# EAGLE design manual_master (EAGLE 8.0.1)
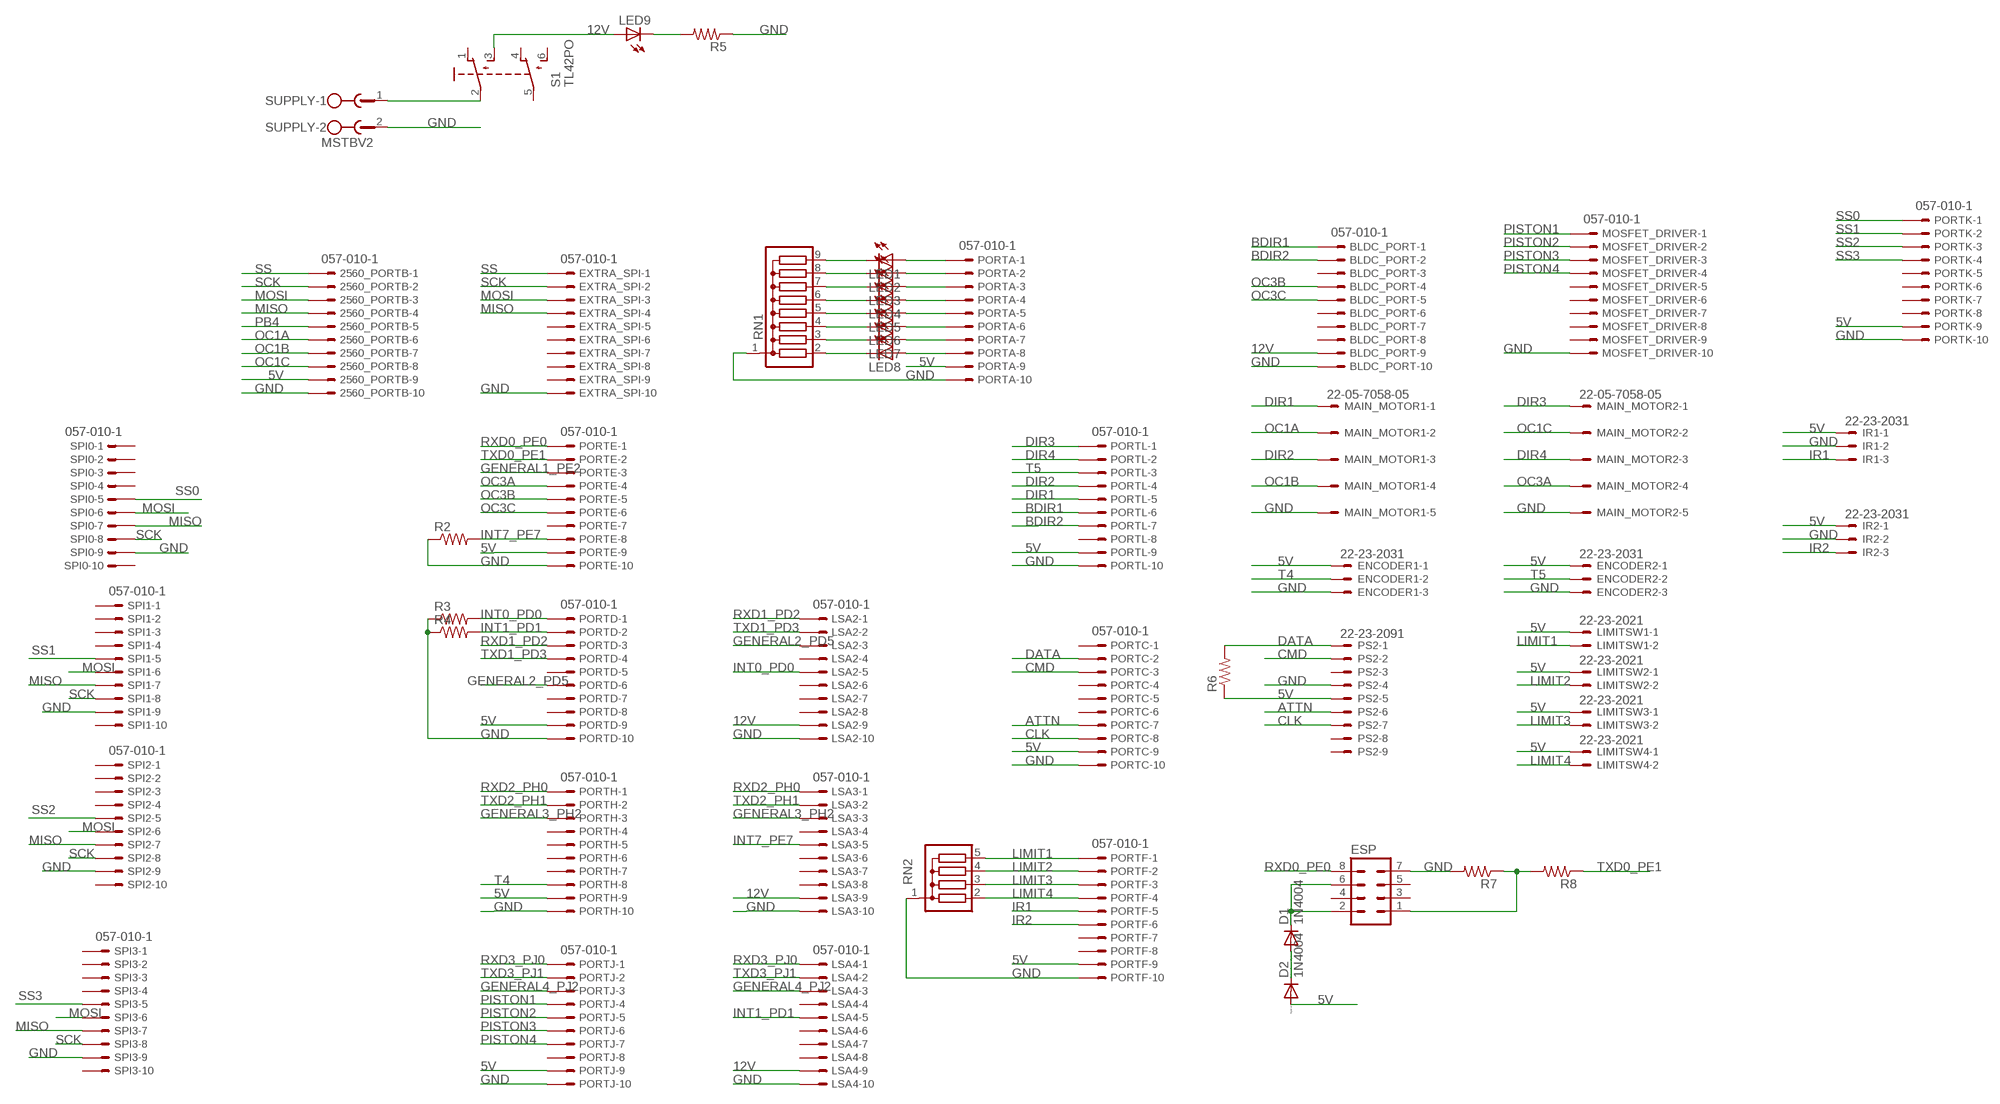
[diagram p0: schematic, sheet 1]

## Parts
2560_PORTB  057-010-1  [057-010-1]
BLDC_PORT  057-010-1  [057-010-1]
D1  1N4004  [DO41-10]
D2  1N4004  [DO41-10]
ENCODER1  22-23-2031  [22-23-2031]
ENCODER2  22-23-2031  [22-23-2031]
ESP  MA04-2  [MA04-2]
EXTRA_SPI  057-010-1  [057-010-1]
IR1  22-23-2031  [22-23-2031]
IR2  22-23-2031  [22-23-2031]
LED1  LED3MM  [LED3MM]
LED2  LED3MM  [LED3MM]
LED3  LED3MM  [LED3MM]
LED4  LED3MM  [LED3MM]
LED5  LED3MM  [LED3MM]
LED6  LED3MM  [LED3MM]
LED7  LED3MM  [LED3MM]
LED8  LED3MM  [LED3MM]
LED9  LED5MM  [LED5MM]
LIMITSW1  22-23-2021  [22-23-2021]
LIMITSW2  22-23-2021  [22-23-2021]
LIMITSW3  22-23-2021  [22-23-2021]
LIMITSW4  22-23-2021  [22-23-2021]
LSA2  057-010-1  [057-010-1]
LSA3  057-010-1  [057-010-1]
LSA4  057-010-1  [057-010-1]
MAIN_MOTOR1  22-05-7058-05  [7395-05]
MAIN_MOTOR2  22-05-7058-05  [7395-05]
MOSFET_DRIVER  057-010-1  [057-010-1]
PORTA  057-010-1  [057-010-1]
PORTC  057-010-1  [057-010-1]
PORTD  057-010-1  [057-010-1]
PORTE  057-010-1  [057-010-1]
PORTF  057-010-1  [057-010-1]
PORTH  057-010-1  [057-010-1]
PORTJ  057-010-1  [057-010-1]
PORTK  057-010-1  [057-010-1]
PORTL  057-010-1  [057-010-1]
PS2  22-23-2091  [22-23-2091]
R2  R-US_0207/10  [0207/10]
R3  R-US_0207/10  [0207/10]
R4  R-US_0207/10  [0207/10]
R5  R-US_0207/10  [0207/10]
R6  R-US_0207/10  [0207/10]
R7  R-US_0207/10  [0207/10]
R8  R-US_0207/10  [0207/10]
RN1  G08R  [SIL9]
RN2  G04R  [SIL5]
S1  TL42PO  [TL4XPO]
SPI0  057-010-1  [057-010-1]
SPI1  057-010-1  [057-010-1]
SPI2  057-010-1  [057-010-1]
SPI3  057-010-1  [057-010-1]
SUPPLY  MSTBV2  [MSTBV2]

## Nets
5V: 2560_PORTB.9 D2.A ENCODER1.1 ENCODER2.1 IR1.1 IR2.1 LIMITSW1.1 LIMITSW2.1 LIMITSW3.1 LIMITSW4.1 PORTA.9 PORTC.9 PORTD.9 PORTE.9 PORTF.9 PORTH.9 PORTJ.9 PORTK.9 PORTL.9 PS2.5 R6.1
12V: BLDC_PORT.9 LED9.A LSA2.9 LSA3.9 LSA4.9 S1.3(S)
ATTN: PORTC.7 PS2.6
BDIR1: BLDC_PORT.1 PORTL.6
BDIR2: BLDC_PORT.2 PORTL.7
CLK: PORTC.8 PS2.7
CMD: PORTC.3 PS2.2
DATA: PORTC.2 PS2.1 R6.2
DIR1: MAIN_MOTOR1.1 PORTL.5
DIR2: MAIN_MOTOR1.3 PORTL.4
DIR3: MAIN_MOTOR2.1 PORTL.1
DIR4: MAIN_MOTOR2.3 PORTL.2
GENERAL1_PE2: PORTE.3
GENERAL2_PD5: LSA2.3 PORTD.6
GENERAL3_PH2: LSA3.3 PORTH.3
GENERAL4_PJ2: LSA4.3 PORTJ.3
GND: 2560_PORTB.10 BLDC_PORT.10 ENCODER1.3 ENCODER2.3 ESP.7 EXTRA_SPI.10 IR1.2 IR2.2 LSA2.10 LSA3.10 LSA4.10 MAIN_MOTOR1.5 MAIN_MOTOR2.5 MOSFET_DRIVER.10 PORTA.10 PORTC.10 PORTD.10 PORTE.10 PORTF.10 PORTH.10 PORTJ.10 PORTK.10 PORTL.10 PS2.4 R2.1 R3.1 R4.1 R5.1 R7.2 RN1.1 RN2.1 SPI0.9 SPI1.9 SPI2.9 SPI3.9 SUPPLY.2
INT0_PD0: LSA2.5 PORTD.1 R3.2
INT1_PD1: LSA4.5 PORTD.2 R4.2
INT7_PE7: LSA3.5 PORTE.8 R2.2
IR1: IR1.3 PORTF.5
IR2: IR2.3 PORTF.6
LIMIT1: LIMITSW1.2 PORTF.1 RN2.5
LIMIT2: LIMITSW2.2 PORTF.2 RN2.4
LIMIT3: LIMITSW3.2 PORTF.3 RN2.3
LIMIT4: LIMITSW4.2 PORTF.4 RN2.2
MISO: 2560_PORTB.4 EXTRA_SPI.4 SPI0.7 SPI1.7 SPI2.7 SPI3.7
MOSI: 2560_PORTB.3 EXTRA_SPI.3 SPI0.6 SPI1.6 SPI2.6 SPI3.6
N$1: D1.A D2.C
N$2: D1.C ESP.2 ESP.6
N$3: S1.2(P) SUPPLY.1
N$4: LED9.K(C) R5.2
N$7: LED1.A PORTA.1
N$12: LED2.A PORTA.2
N$13: LED3.A PORTA.3
N$14: LED4.A PORTA.4
N$15: LED5.A PORTA.5
N$16: LED6.A PORTA.6
N$17: LED7.A PORTA.7
N$18: LED8.A PORTA.8
N$19: LED1.K(C) RN1.9
N$20: LED2.K(C) RN1.8
N$21: ESP.1 R7.1 R8.2
N$22: LED3.K(C) RN1.7
N$23: LED4.K(C) RN1.6
N$24: LED5.K(C) RN1.5
N$25: LED6.K(C) RN1.4
N$26: LED7.K(C) RN1.3
N$27: LED8.K(C) RN1.2
OC1A: 2560_PORTB.6 MAIN_MOTOR1.2
OC1B: 2560_PORTB.7 MAIN_MOTOR1.4
OC1C: 2560_PORTB.8 MAIN_MOTOR2.2
OC3A: MAIN_MOTOR2.4 PORTE.4
OC3B: BLDC_PORT.4 PORTE.5
OC3C: BLDC_PORT.5 PORTE.6
PB4: 2560_PORTB.5
PISTON1: MOSFET_DRIVER.1 PORTJ.4
PISTON2: MOSFET_DRIVER.2 PORTJ.5
PISTON3: MOSFET_DRIVER.3 PORTJ.6
PISTON4: MOSFET_DRIVER.4 PORTJ.7
RXD0_PE0: ESP.8 PORTE.1
RXD1_PD2: LSA2.1 PORTD.3
RXD2_PH0: LSA3.1 PORTH.1
RXD3_PJ0: LSA4.1 PORTJ.1
SCK: 2560_PORTB.2 EXTRA_SPI.2 SPI0.8 SPI1.8 SPI2.8 SPI3.8
SS: 2560_PORTB.1 EXTRA_SPI.1
SS0: PORTK.1 SPI0.5
SS1: PORTK.2 SPI1.5
SS2: PORTK.3 SPI2.5
SS3: PORTK.4 SPI3.5
T4: ENCODER1.2 PORTH.8
T5: ENCODER2.2 PORTL.3
TXD0_PE1: PORTE.2 R8.1
TXD1_PD3: LSA2.2 PORTD.4
TXD2_PH1: LSA3.2 PORTH.2
TXD3_PJ1: LSA4.2 PORTJ.2
Unconnected: BLDC_PORT.3 BLDC_PORT.6 BLDC_PORT.7 BLDC_PORT.8 ESP.3 ESP.4 ESP.5 EXTRA_SPI.5 EXTRA_SPI.6 EXTRA_SPI.7 EXTRA_SPI.8 EXTRA_SPI.9 LSA2.4 LSA2.6 LSA2.7 LSA2.8 LSA3.4 LSA3.6 LSA3.7 LSA3.8 LSA4.4 LSA4.6 LSA4.7 LSA4.8 MOSFET_DRIVER.5 MOSFET_DRIVER.6 MOSFET_DRIVER.7 MOSFET_DRIVER.8 MOSFET_DRIVER.9 PORTC.1 PORTC.4 PORTC.5 PORTC.6 PORTD.5 PORTD.7 PORTD.8 PORTE.7 PORTF.7 PORTF.8 PORTH.4 PORTH.5 PORTH.6 PORTH.7 PORTJ.8 PORTK.5 PORTK.6 PORTK.7 PORTK.8 PORTL.8 PS2.3 PS2.8 PS2.9 S1.1(O) S1.4(O1) S1.5(P1) S1.6(S1) SPI0.1 SPI0.2 SPI0.3 SPI0.4 SPI0.10 SPI1.1 SPI1.2 SPI1.3 SPI1.4 SPI1.10 SPI2.1 SPI2.2 SPI2.3 SPI2.4 SPI2.10 SPI3.1 SPI3.2 SPI3.3 SPI3.4 SPI3.10

## Library data of the parts
2560_PORTB BLDC_PORT EXTRA_SPI LSA2-LSA4 MOSFET_DRIVER PORTA PORTC PORTD PORTE PORTF PORTH PORTJ PORTK PORTL SPI0 SPI1-SPI3 = con-panduit:057-010-: CONNECTOR 10-pin series 057 contact pc board low profile headers; OC_FARNELL: unknown; OC_NEWARK: unknown
D1 D2 = diode:1N4004: DIODE general purpose rectifier, 1 A
ENCODER1 ENCODER2 IR1 IR2 = con-molex:22-23-2031: .100" (2.54mm) Center Header - 3 Pin; MF: MOLEX; MPN: 22-23-2031; OC_FARNELL: 1462950; OC_NEWARK: 30C0862
ESP = con-lstb:MA04-2: PIN HEADER; OC_FARNELL: unknown; OC_NEWARK: unknown
LED1-LED9 = led:LED: LED OSRAM: - CHIPLED LG R971, LG N971, LY N971, LG Q971, LY Q971, LO R971, LY R971 LH N974, LH R974 LS Q976, LO Q976, LY Q976 LO Q996 - Hyper CHIPLED LW Q18S LB Q993, LB Q99A, LB R99A - SideLED LS A670, LO A670, LY A670, LG A670, LP A670 LB A673, LV A673, LT A673, LW A673 LH A674 LY A675 LS A676, LA A676, LO A676, LY A676, LW A676 LS A679, LY A679, LG A679 - Hyper Micro SIDELED® LS Y876, LA Y876, LO Y876, LY Y876 LT Y87S - SmartLED LW L88C, LW L88S LB L89C, LB L89S, LG L890 LS L89K, LO L89K, LY L89K LS L896, LA L896, LO L896, LY L896 - TOPLED LS T670, LO T670, LY T670, LG T670, LP T670 LSG T670, LSP T670, LSY T670, LOP T670, LYG T670 LG T671, LOG T671, LSG T671 LB T673, LV T673, LT T673, LW T673 LH T674 LS T676, LA T676, LO T676, LY T676, LB T676, LH T676, LSB T676, LW T676 LB T67C, LV T67C, LT T67C, LS T67K, LO T67K, LY T67K, LW E67C LS E67B, LA E67B, LO E67B, LY E67B, LB E67C, LV E67C, LT E67C LW T67C LS T679, LY T679, LG T679 LS T770, LO T770, LY T770, LG T770, LP T770 LB T773, LV T773, LT T773, LW T773 LH T774 LS E675, LA E675, LY E675, LS T675 LS T776, LA T776, LO T776, LY T776, LB T776 LHGB T686 LT T68C, LB T68C - Hyper Mini TOPLED® LB M676 - Mini TOPLED Santana® LG M470 LS M47K, LO M47K, LY M47K Source: http://www.osram.convergy.de LUXEON: - LUMILED® LXK2-PW12-R00, LXK2-PW12-S00, LXK2-PW14-U00, LXK2-PW14-V00 LXK2-PM12-R00, LXK2-PM12-S00, LXK2-PM14-U00 LXK2-PE12-Q00, LXK2-PE12-R00, LXK2-PE12-S00, LXK2-PE14-T00, LXK2-PE14-U00 LXK2-PB12-K00, LXK2-PB12-L00, LXK2-PB12-M00, LXK2-PB14-N00, LXK2-PB14-P00, LXK2-PB14-Q00 LXK2-PR12-L00, LXK2-PR12-M00, LXK2-PR14-Q00, LXK2-PR14-R00 LXK2-PD12-Q00, LXK2-PD12-R00, LXK2-PD12-S00 LXK2-PH12-R00, LXK2-PH12-S00 LXK2-PL12-P00, LXK2-PL12-Q00, LXK2-PL12-R00 Source: www.luxeon.com KINGBRIGHT: KA-3528ASYC Source: www.kingbright.com
LIMITSW1-LIMITSW4 = con-molex:22-23-2021: .100" (2.54mm) Center Header - 2 Pin; MF: MOLEX; MPN: 22-23-2021; OC_FARNELL: 1462926; OC_NEWARK: 25C3832
MAIN_MOTOR1 MAIN_MOTOR2 = con-molex:22-?-05: CONNECTOR wire to board 2.54 mm (.1 inch) pitch header; OC_FARNELL: unknown; OC_NEWARK: unknown
PS2 = con-molex:22-23-2091: .100" (2.54mm) Center Header - 9 Pin; MF: MOLEX; MPN: 22-23-2091; OC_FARNELL: 1756827; OC_NEWARK: 56H0450
R2-R8 = rcl:R-US_: RESISTOR, American symbol
RN1 = resistor-sil:G08R: SIL RESISTOR; OC_FARNELL: unknown; OC_NEWARK: unknown
RN2 = resistor-sil:G04R: SIL RESISTOR; OC_FARNELL: unknown; OC_NEWARK: unknown
S1 = switch:TL42PO: TINY SWITCH ON - MOM Source: http://www2.produktinfo.conrad.com/datenblaetter/700000-724999/705152-da-01-de-Subminiaturschalter_TL_36YO.pdf
SUPPLY = con-phoenix-508:MSTBV2: PHOENIX; MPN: MSTBV 2,5/2-GF-5.08; OC_FARNELL: 1792792; OC_NEWARK: 69R9845

## Board
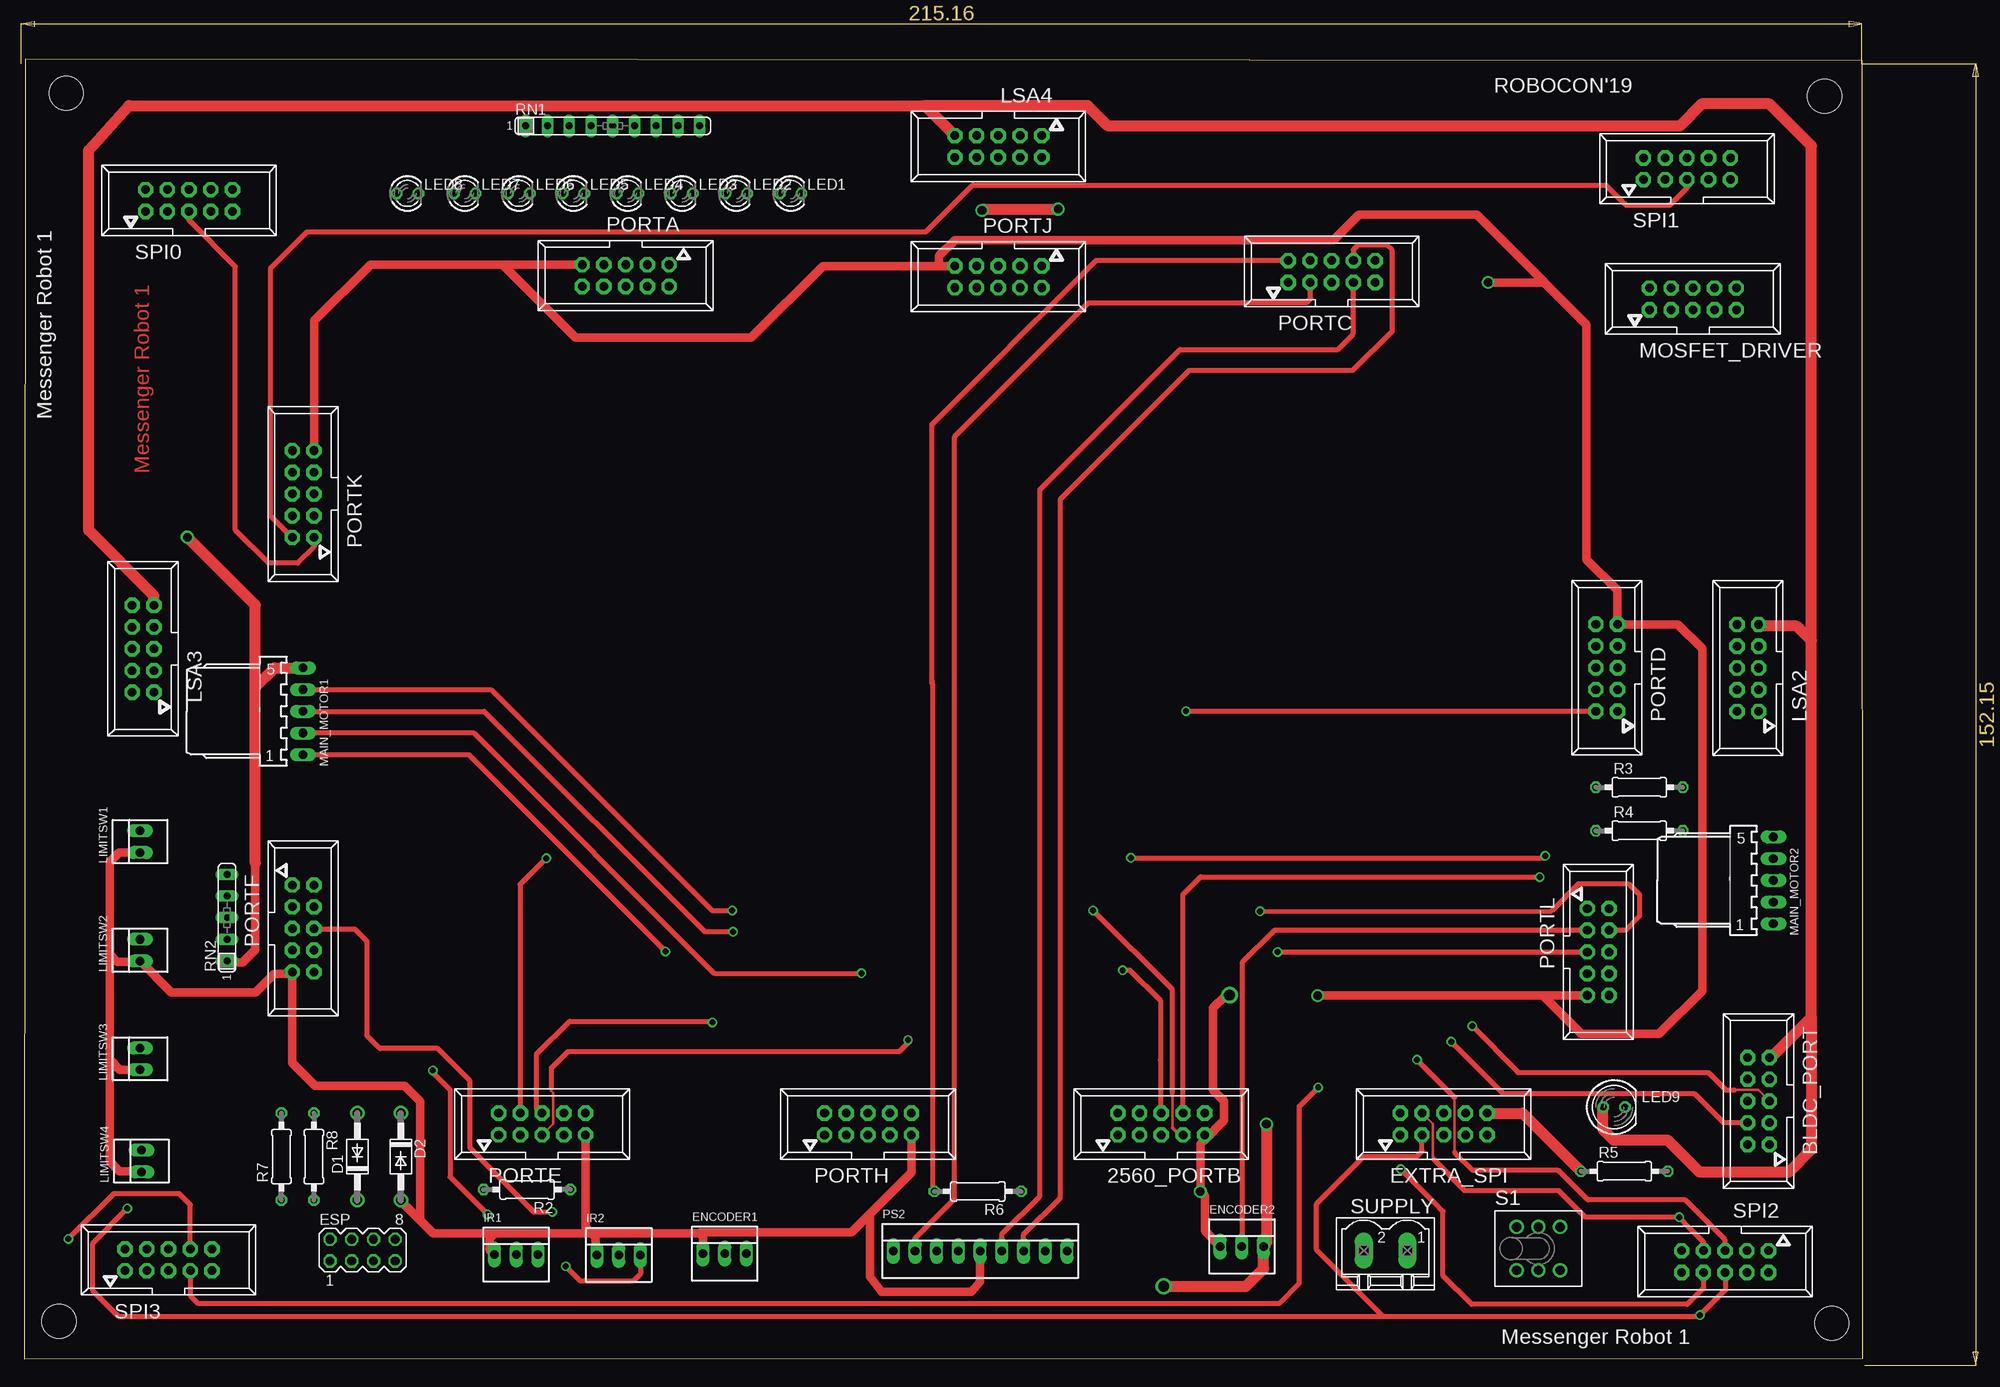
[diagram p1: board, top side]
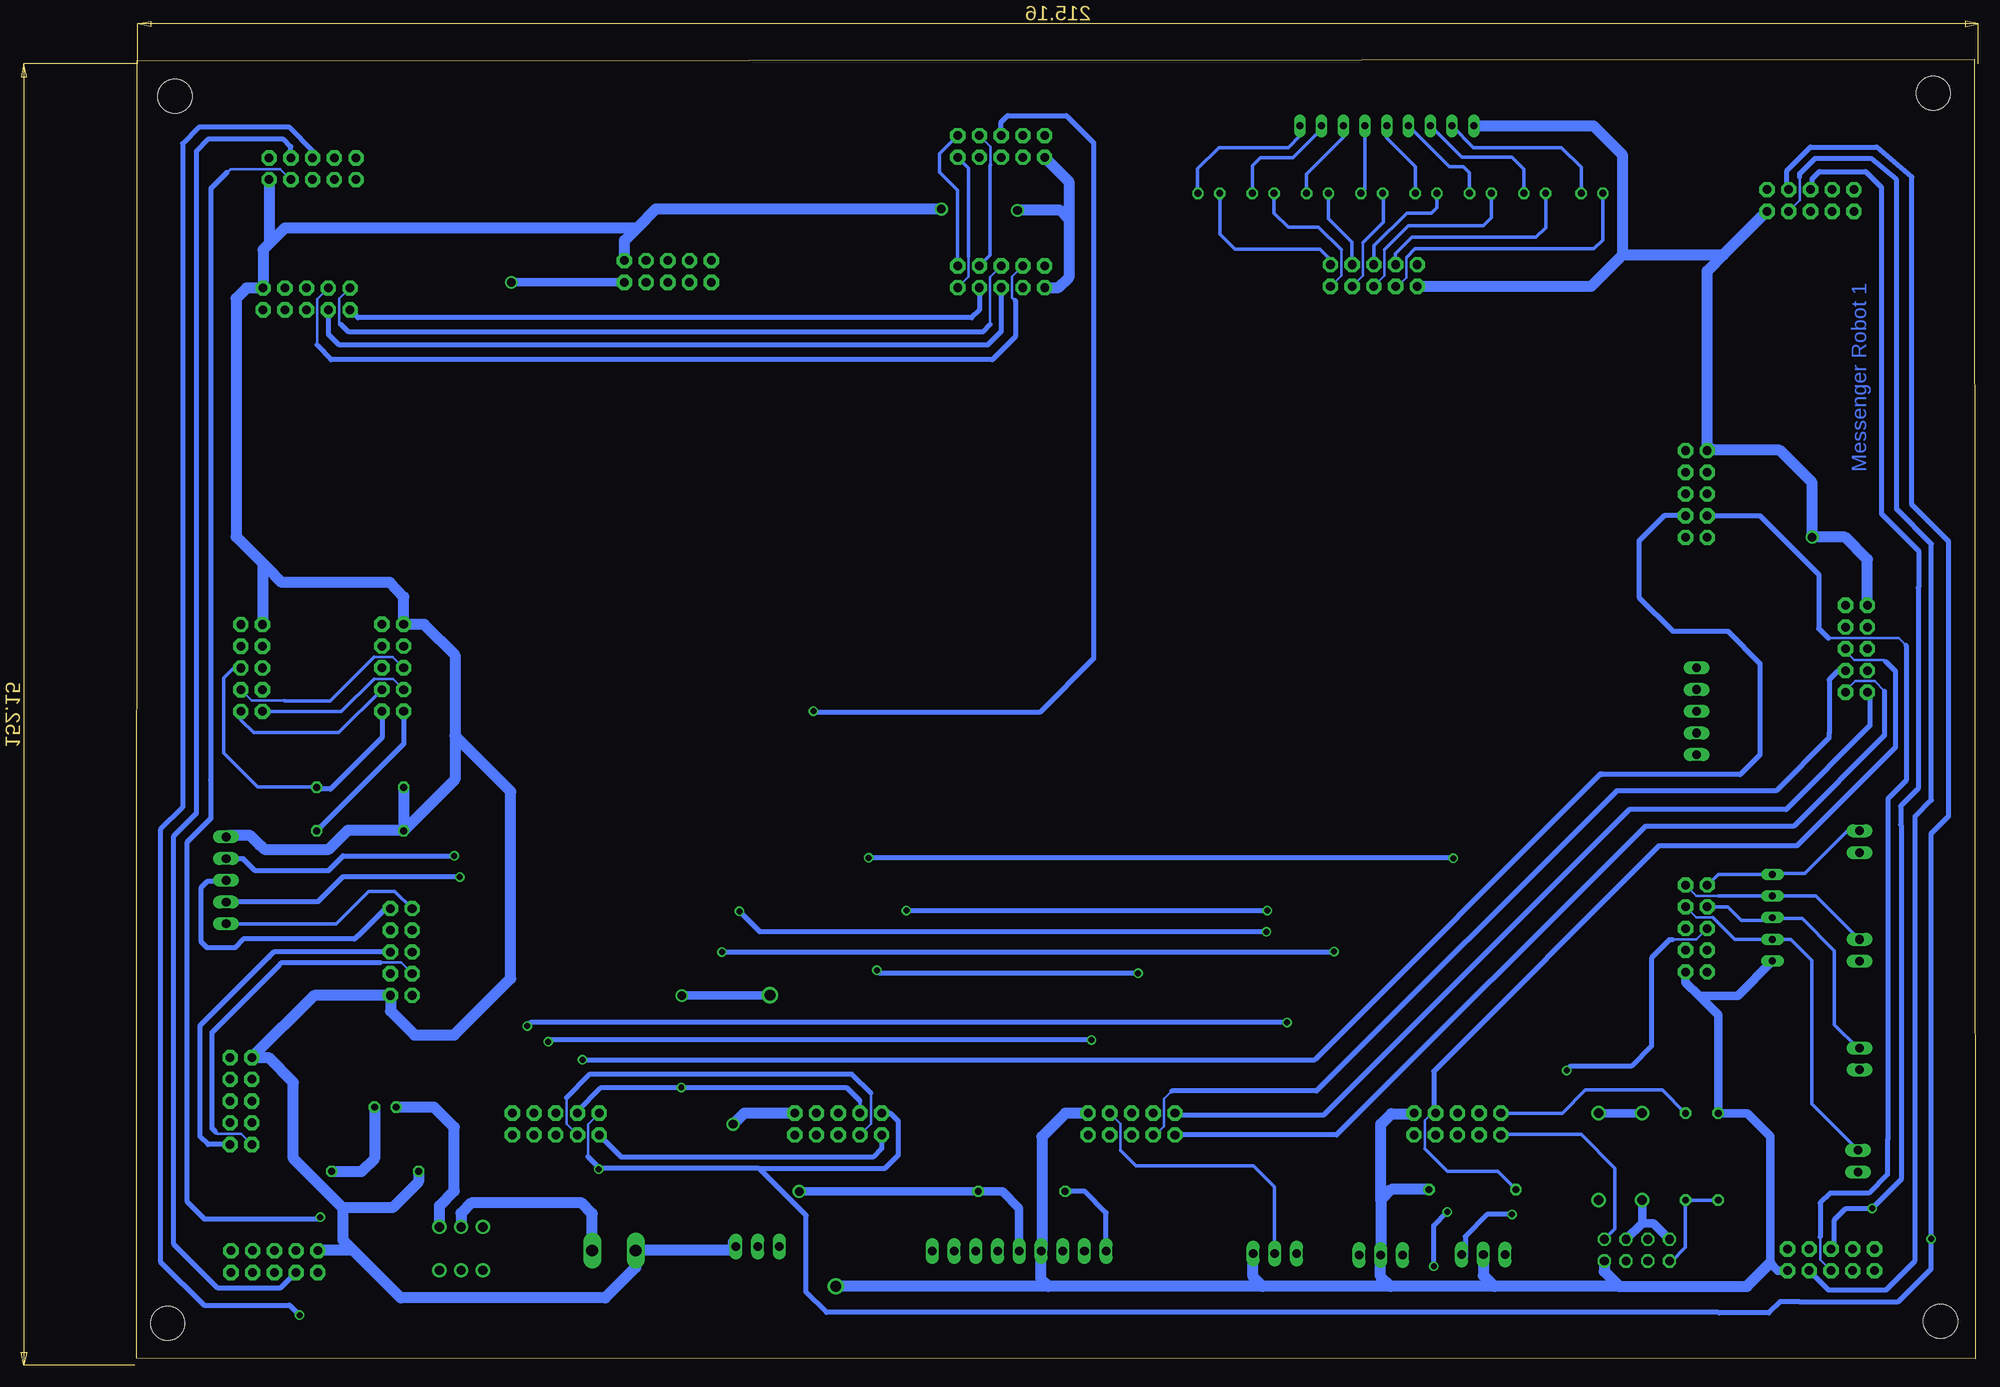
[diagram p2: board, bottom side, seen from below]

Size 214.91 x 151.97 mm. Coordinates in mm from the lower left corner, seen from the top.
Outline: 0,0 214.91,0.07 214.86,151.77 0.1,151.97 0,0
Copper layers (1*16): Top 0.035mm / dielectric 1.5mm / Bottom 0.035mm
Design rules "default *": minimum track width 10mil, minimum drill 24mil, track to track 8mil, track to pad 8mil, pad to pad 8mil, via to via 8mil, smd to smd 8mil, copper to edge 40mil, drill to drill 8mil, minimum pad ring 10mil, minimum via ring 8mil, stop-mask expansion 10mil, vias tented up to drill 15mil, thermal gap 10mil
Holes 4 mm at 4.05,4.39 211.3,4.19 210.45,147.64 4.9,147.99

### Footprints (pad centres in the part's own frame; a part is rotated, then mirrored left to right if it is on the bottom)
057-010-1 = drill 1 pad 1.778 octagon: 1 -5.08,-1.27; 2 -5.08,1.27; 3 -2.54,-1.27; 4 -2.54,1.27; 5 0,-1.27; 6 0,1.27; 7 2.54,-1.27; 8 2.54,1.27; 9 5.08,-1.27; 10 5.08,1.27
DO41-10 = drill 1.118: A 5.08,0; C -5.08,0
22-23-2031 = drill 1 long: 1 -2.54,0; 2 0,0; 3 2.54,0
MA04-2 = drill 1.016 octagon: 1 -3.81,-1.27; 2 -3.81,1.27; 3 -1.27,-1.27; 4 -1.27,1.27; 5 1.27,-1.27; 6 1.27,1.27; 7 3.81,-1.27; 8 3.81,1.27
LED3MM = drill 0.813 octagon: A -1.27,0; K 1.27,0
LED5MM = drill 0.813 octagon: A -1.27,0; K 1.27,0
22-23-2021 = drill 1 long: 1 -1.27,0; 2 1.27,0
7395-05 = drill 1.016 long: 1 5.08,0; 2 2.54,0; 3 0,0; 4 -2.54,0; 5 -5.08,0
22-23-2091 = drill 1 long: 1 -10.16,0; 2 -7.62,0; 3 -5.08,0; 4 -2.54,0; 5 0,0; 6 2.54,0; 7 5.08,0; 8 7.62,0; 9 10.16,0
0207/10 = drill 0.813 octagon: 1 -5.08,0; 2 5.08,0
SIL9 = drill 0.813 long: 1 -10.16,0; 2 -7.62,0; 3 -5.08,0; 4 -2.54,0; 5 0,0; 6 2.54,0; 7 5.08,0; 8 7.62,0; 9 10.16,0
SIL5 = drill 0.813 long: 1 -5.08,0; 2 -2.54,0; 3 0,0; 4 2.54,0; 5 5.08,0
TL4XPO = drill 1.1 pad 1.676: 1 -2.54,2.54; 2 0,2.54; 3 2.54,2.54; 4 -2.54,-2.54; 5 0,-2.54; 6 2.54,-2.54
MSTBV2 = drill 1.397 long: 1 -2.54,0; 2 2.54,0

### Placement (x,y rotation side)
2560_PORTB  132.91,27.47 0 top
BLDC_PORT  202.73,30.16 90 top
D1  38.93,23.66 90 top
D2  44.01,23.66 270 top
ENCODER1  81.87,12.31 0 top
ENCODER2  142.33,13.16 0 top
ESP  39.54,12.72 0 top
EXTRA_SPI  165.93,27.47 0 top
IR1  57.49,12.21 0 top
IR2  69.49,12.16 0 top
LED1  89.58,136.28 0 top
LED2  83.23,136.28 0 top
LED3  76.88,136.28 0 top
LED4  70.53,136.28 0 top
LED5  64.18,136.28 0 top
LED6  57.83,136.28 0 top
LED7  51.48,136.28 0 top
LED8  44.78,136.28 0 top
LED9  185.85,29.45 0 top
LIMITSW1  13.53,60.49 90 top
LIMITSW2  13.53,47.79 90 top
LIMITSW3  13.53,35.09 90 top
LIMITSW4  13.68,23.14 90 top
LSA2  201.48,80.79 90 top
LSA3  13.87,83.03 90 top
LSA4  113.86,141.77 180 top
MAIN_MOTOR1  32.58,75.73 270 top
MAIN_MOTOR2  204.46,55.96 270 top
MOSFET_DRIVER  195.06,123.94 0 top
PORTA  70.29,126.68 180 top
PORTC  152.83,127.15 0 top
PORTD  184.98,80.81 90 top
PORTE  60.52,27.47 0 top
PORTF  32.58,50.33 270 top
PORTH  98.62,27.47 0 top
PORTJ  113.86,126.53 180 top
PORTK  32.58,101.13 90 top
PORTL  183.99,47.59 270 top
PS2  111.74,12.63 0 top
R2  58.76,19.81 180 top
R3  188.79,66.84 0 top
R4  188.79,61.76 0 top
R5  187.04,21.95 0 top
R6  111.46,19.6 180 top
R7  30.04,23.66 90 top
R8  33.85,23.66 270 top
RN1  68.78,144.17 0 top
RN2  23.69,51.6 90 top
S1  176.99,12.91 0 top
SPI0  19.25,135.45 0 top
SPI1  194.36,139.16 0 top
SPI2  198.83,11.39 180 top
SPI3  16.85,11.59 0 top
SUPPLY  159.12,12.68 180 top

### Tracks (layer width: path | path; a pad name or v marks a point on that pad's centre or on a via)
5V  (via drill 1, 1.27)
  Top 1.016: 54.5,14.19 55,14.69 | 55,14.69 66.3,14.69 | 66.3,14.69 66.75,14.24 66.75,12.36 IR2.1 | LIMITSW1.1 11.08,59.22 9.95,58.09 9.95,47.34 | 9.95,47.34 10.85,46.44 13.45,46.44 LIMITSW2.1 17.16,42.89 27.05,42.89 29.2,45.04 31.1,45.04 PORTF.9 31.31,34.63 34,31.94 44.45,31.94 46.25,30.14 46.25,16.24 | 9.95,35.04 9.95,47.34 | 9.95,35.04 9.95,23.09 11.1,21.94 13.61,21.94 LIMITSW4.1 | LIMITSW3.1 11.17,33.82 9.95,35.04 | 116.45,19.69 R6.1 | 78.9,14.69 66.3,14.69 | PORTE.9 65.6,15.39 66.3,14.69 | 137.99,25.64 2560_PORTB.9 | ENCODER2.1 137.99,14.96 137.99,19.09 v137.48,19.6 137.48,25.14 137.99,25.64 | 54.4,14.69 47.8,14.69 46.25,16.24 | 54.4,14.69 55,14.69 | D2.A 44.01,18.48 46.25,16.24 | PORTH.9 103.7,21.84 98.85,16.99 | 78.9,14.69 79.05,14.84 96.7,14.84 98.85,16.99 | ENCODER1.1 79.33,14.26 78.9,14.69 | PS2.5 111.74,9.03 110.75,7.84 100.2,7.84 98.85,9.59 98.85,16.99 | IR1.1 54.4,12.76 54.4,14.69 | 55.9,127.95 PORTA.9 | 55.9,127.95 40.46,127.95 33.9,121.39 33.9,106.26 PORTK.9 | 106.6,127.8 PORTJ.9 | 106.6,127.8 93.36,127.8 84.95,119.39 64.46,119.39 55.9,127.95 | 177.7,125.84 182.6,120.94 182.6,93.49 186.2,89.89 186.2,85.94 PORTD.9 193.3,85.89 196.15,83.04 196.15,43.04 191.1,37.99 182.02,37.99 177.5,42.51 | 177.7,125.84 177.7,125.89 169.8,133.79 156,133.79 153.05,130.84 108.8,130.84 106.95,128.99 106.95,128.15 106.6,127.8 | 177.5,42.51 PORTL.9 | 177.5,42.51 151.17,42.51 151.15,42.49 v151.2,42.49 | 137.99,25.64 140.25,27.91 140.25,30.19 138.95,31.49 138.95,41.04 140.45,42.54 v140.89,42.54 | 177.7,125.84 171.15,125.84 v171.11,125.88
  Bottom 1.016: PS2.5 111.75,17.64 113.71,19.6 R6.1 v137.48,19.6 | PORTC.9 v171.11,125.88 | 140.9,42.44 141,42.54 v140.89,42.54 140.94,42.49 v151.2,42.49
12V
  Top 1.27: BLDC_PORT.9 204.2,35.24 208.9,39.94 | 208.9,39.94 208.9,83.99 | 208.9,83.99 207.2,85.69 202.93,85.69 LSA2.9 | LSA3.9 15.14,89.25 7.5,96.89 7.5,141.29 12.25,146.54 105.28,146.54 | 105.28,146.54 LSA4.9 | 208.9,83.99 208.9,141.84 204,146.74 196.1,146.74 193.5,144.14 126.7,144.14 124.3,146.54 105.28,146.54 | 208.9,39.94 208.9,24.49 206.25,21.84 195.85,21.84 192.1,25.59 185.8,25.59 184.55,26.84 184.55,29.42 LED9.A
  Bottom 1.016: LED9.A 184.54,29.49
  Bottom 1.27: S1.3 179.53,17.91 177.8,19.64 177.8,27.09 180.15,29.44 LED9.A
ATTN
  Top 0.61: PS2.6 114.28,14.62 118.7,19.04 118.7,101.64 135.1,118.04 153.55,118.04 155.35,119.84 155.35,125.86 PORTC.7
BDIR1
  Bottom 0.61: BLDC_PORT.1 206.59,25.08 207.5,25.99 207.5,38.99 199.72,46.77 | 199.72,46.77 199.4,47.09 | PORTL.6 198.9,47.59 199.72,46.77
BDIR2
  Bottom 0.305: BLDC_PORT.2 202.72,26.34 205.5,26.34 205.7,26.54 | 186.4,46.34 184.01,46.34 PORTL.7
  Bottom 0.406: 205.7,26.54 205.65,26.54
  Bottom 0.61: 205.7,26.54 206.1,26.94 206.1,38.19 198.25,46.04 198.25,46.09 198,46.34 186.4,46.34
CLK
  Top 0.61: PS2.7 116.82,14.56 121.1,18.84 121.1,100.54 136.12,115.56 155.28,115.56 159.9,120.19 159.9,129.64 159.3,130.24 155.9,130.24 155.35,129.69 155.35,128.44 PORTC.8
CMD
  Top 0.61: PS2.2 104.12,14.11 108.75,18.74 108.75,107.84 124.4,123.49 149.85,123.49 150.35,123.99 150.35,125.82 PORTC.3
DATA
  Top 0.61: 106.15,78.89 106.15,79.29 | 106.15,78.89 106.15,19.83 R6.2 | 106.15,78.89 106.05,78.99 106.05,109.19 115.15,118.29 115.15,118.34 118.4,121.59 118.45,121.59 120.43,123.56 | 120.43,123.56 121.2,124.34 | PORTC.2 125.28,128.42 120.43,123.56
  Bottom 0.61: PS2.1 101.58,17.12 104.05,19.59 R6.2
DIR1  (via drill 0.7)
  Top 0.61: MAIN_MOTOR1.1 51.94,70.65 v74.95,47.64 | PORTL.5 182.67,47.64 182.62,47.59 v146.5,47.59
  Bottom 0.61: v74.95,47.64 75,47.59 v146.5,47.59
DIR2  (via drill 0.7)
  Top 0.61: MAIN_MOTOR1.3 53.76,75.73 79.5,49.99 82.8,49.99 v82.85,49.94 | v144.45,52.34 178.55,52.39 181.75,55.59 187.5,55.59 188.8,54.29 188.8,51.79 187.14,50.13 PORTL.4
  Bottom 0.61: v82.85,49.94 142.05,49.94 v144.45,52.34
DIR3
  Bottom 0.406: PORTL.1 184.74,54.69 187.8,54.69 191.61,50.88 MAIN_MOTOR2.1
DIR4
  Bottom 0.406: 185.26,52.5 PORTL.2 | MAIN_MOTOR2.3 204.43,55.99
  Bottom 0.61: PORTL.2 185.82,52.67 189.05,49.44 189.1,49.44 189.45,49.09 202.45,49.09 203.45,48.09 206.7,48.09 207.35,48.74 207.35,55.14 206.6,55.89 204.53,55.89 MAIN_MOTOR2.3
GENERAL2_PD5
  Bottom 0.305: LSA2.3 201.49,76.99 197.65,76.99 | 187.15,82.09 184.99,82.09 PORTD.6
  Bottom 0.406: 187.15,82.09 192.3,76.94 197.6,76.94 197.65,76.99
GENERAL3_PH2
  Bottom 0.305: 93.9,31.34 94.8,30.44 94.8,27.19 95.79,26.2 PORTH.3
  Bottom 0.61: LSA3.3 15.24,80.39 16.1,80.39 17.05,79.44 17.05,73.14 17.1,73.09 17.1,72.59 23.25,66.44 41.9,66.44 77,31.34 93.9,31.34
GENERAL4_PJ2
  Bottom 0.305: LSA4.3 115.1,141.74 115.1,141.02 115.11,141.02 115.11,139.98 115.1,139.98 115.1,139.69
  Bottom 0.406: PORTJ.3 115.15,129.05 115.15,139.54 115.1,139.59 115.1,139.69
GND  (via drill 1, 1.27)
  Top 1.016: 27,57.99 27,47.84 25.55,46.39 23.82,46.39 RN2.1 | ENCODER2.3 144.9,13.13
  Top 1.27: EXTRA_SPI.10 175.17,28.74 R5.1 | v145.2,27.44 145.2,13.49 ENCODER2.3 144.87,10.56 142.8,8.49 v133.2,8.49 | MAIN_MOTOR1.5 29.25,80.81 27,78.56 | 27,57.99 27,78.56 | 27,78.56 27,88.14 v19.05,96.09 | v111.95,134.29 112.1,134.44 v120.85,134.44
  Bottom 0.406: R7.2
  Bottom 1.016: LSA4.10 108.78,140.27 | RN2.1 27.77,42.44 32.25,42.44 | 32.25,42.44 33.85,44.04 PORTF.10 | 43.6,11.7 ESP.7 | 32.25,42.44 30.04,40.23 R7.2 26.65,28.74 23.95,26.04 23.95,11.22 23.05,10.32 SPI3.9 | 69.55,12.1 IR2.2 | 185.28,42.49 PORTL.10 | PORTK.10 31.23,106.29 30.55,106.29 30.8,106.54 | 200.15,129.69 199.75,130.09
  Bottom 1.27: 189.6,12.69 184.05,7.14 160.15,7.14 156.58,10.71 SUPPLY.2 145.35,12.68 ENCODER2.3 145.2,13.49 145.2,13.69 145.15,13.64 | 189.6,12.69 193.72,12.69 SPI2.9 | 189.6,12.69 190.8,13.89 190.8,17.64 190.85,17.69 | 190.85,17.69 196.6,23.44 196.6,32.34 199.5,35.24 BLDC_PORT.10 194.19,42.51 PORTL.10 185.26,40.7 182.45,37.89 177.8,37.89 171.2,44.49 171.2,66.35 177.7,72.85 | R5.1 181.96,20.73 185,17.69 190.85,17.69 | 204.41,61.09 MAIN_MOTOR2.5 204.31,61.19 201.65,61.19 200.55,60.09 200.5,60.09 200,59.59 192.45,59.59 190.2,61.84 183.79,61.84 R4.1 | 177.7,72.85 177.7,82.29 181.3,85.89 PORTD.10 183.71,89.1 185.3,90.79 197.95,90.79 199.75,92.59 | LSA2.10 200.21,92.99 199.75,92.53 199.75,92.59 | 177.7,72.85 177.7,67.77 R4.1 | R3.1 R4.1 | LSA3.10 12.6,93.49 15.2,96.09 v19.05,96.09 19.05,102.44 22.85,106.24 31.18,106.24 31.23,106.29 | PORTK.10 31.31,127.2 29.42,129.09 | 29.42,129.09 SPI0.9 | PORTA.10 44.88,125.41 41.2,129.09 | 41.2,129.09 41.2,140.74 44.6,144.14 58.59,144.14 RN1.1 | 41.2,129.09 29.42,129.09 | PORTJ.10 107.13,125.26 105.95,126.44 105.95,133.29 | 105.95,133.29 105.95,137.67 LSA4.10 | 156.45,132.24 197.6,132.24 199.75,130.09 200.14,129.7 MOSFET_DRIVER.10 202.08,125.21 203.3,123.99 203.3,96.14 199.75,92.59 | PORTC.10 157.91,130.78 156.45,132.24 | SPI1.9 199.44,130.4 200.15,129.69 | 2560_PORTB.10 143.9,28.74 v145.2,27.44 | PORTH.10 106.35,28.74 109.1,25.99 109.1,12.73 PS2.4 109.2,9.34 108.35,8.49 | IR1.2 57.49,9.78 56.2,8.49 | 41.6,8.49 56.2,8.49 | 41.6,8.49 26.68,8.49 23.95,11.22 | ESP.7 43.35,10.24 41.6,8.49 | 56.2,8.49 68.35,8.49 | 68.35,8.49 69.5,9.64 IR2.2 69.49,18.59
  Bottom 1.27: 69.49,18.59 69.49,27.45 68.25,28.69 65.65,28.69 PORTE.10 | R2.1 68.27,19.81 69.49,18.59 | 68.35,8.49 83.3,8.49 | 83.3,8.49 84.4,9.59 ENCODER1.3 | 83.3,8.49 108.35,8.49 | 108.35,8.49 v133.2,8.49 | 105.95,133.29 106.95,134.29 v111.95,134.29 | v120.85,134.44 154.25,134.44 156.45,132.24
INT0_PD0
  Bottom 0.406: LSA2.5 203.6,80.79 204.75,79.64 204.75,70.84 200.8,66.89 193.92,66.89 R3.2
  Bottom 0.61: 193.82,66.89 R3.2 193.67,66.64 192.25,66.64 186.25,72.64 PORTD.1
INT1_PD1  (via drill 0.7)
  Top 0.61: PORTD.2 183.62,75.64 183.52,75.74 v135.8,75.74
  Bottom 0.61: LSA4.5 113.86,144.63 113.1,145.39 106.25,145.39 103.05,142.19 103.05,81.89 109.35,75.59 135.65,75.59 v135.8,75.74 | 183.57,75.59 PORTD.2 183.71,71.92 R4.2
INT7_PE7
  Bottom 0.305: 10.4,81.49 10.65,81.74 14.1,81.74 15.14,82.78 LSA3.5 | 64.35,24.59 64.35,27.93 63.54,28.74 PORTE.8
  Bottom 0.406: 64.35,24.59 61.7,21.94 55.81,21.94 R2.2
  Bottom 0.61: 10.25,70.59 20.8,60.04 36.9,60.04 63.3,33.64 63.3,28.98 PORTE.8 | 10.25,70.59 10.2,70.59 | 10.25,70.59 9.3,71.54 9.3,80.39 10.4,81.49 10.45,81.49
IR1  (via drill 0.7)
  Top 0.61: v54.15,16.89 49.75,21.29 49.75,31.49 47.75,33.49 v47.75,33.74
  Bottom 0.305: 35.35,49.04 32.6,49.04 PORTF.5
  Bottom 0.61: 35.35,49.04 35.7,49.04 37.85,46.89 37.85,36.59 40.2,34.24 47.3,34.24 47.75,33.79 v47.75,33.74 | IR1.3 59.6,11.83 59.6,14.34 57.05,16.89 v54.15,16.89
IR2  (via drill 0.7)
  Top 0.61: IR2.3 72.03,9.97 71.15,9.09 65.05,9.09 v63.3,10.84 | PORTF.6 33.94,50.24 38.65,50.24 40.05,48.84 40.05,37.79 41.55,36.29 48.3,36.29 52.1,32.49 52.1,24.69 53.25,23.54 53.25,23.49 59.55,17.19 v61.7,17.19
  Bottom 0.61: v63.3,10.84 63.3,15.59 v61.7,17.19
LIMIT1
  Bottom 0.406: RN2.5 30.04,56.68 PORTF.1 | 13.56,61.79 LIMITSW1.2 14.93,61.76 19.9,56.79 23.58,56.79 RN2.5 | 22.46,56.68 RN2.5
LIMIT2
  Bottom 0.305: PORTF.2 32.58,54.14 30,54.14
  Bottom 0.406: LIMITSW2.2 18.61,54.14 23.3,54.14 RN2.4 30,54.14
LIMIT3
  Bottom 0.406: 23.65,51.64 RN2.3 | RN2.3 23.58,51.49 20.2,51.49 16.45,47.74 16.45,39.09 13.72,36.36 LIMITSW3.2 | RN2.3 24,51.29 27.35,51.29 28.93,52.87 PORTF.3
LIMIT4
  Bottom 0.305: 30.65,51.64 30.78,51.64 30.79,51.62 32.6,51.62 PORTF.4
  Bottom 0.406: RN2.2 23.67,49.04 | LIMITSW4.2 19.1,29.83 19.1,46.59 21.57,49.06 RN2.2 | 30.65,51.64 28.07,49.06 RN2.2
MISO  (via drill 0.7)
  Top 0.305: EXTRA_SPI.4 164.65,27.48 164.65,23.44 164.75,23.34
  Top 0.406: 164.75,23.34 164.75,23.44
  Top 0.61: SPI2.7 196.29,13.7 194.75,15.24 | 194.75,15.24 194.75,15.29 | 164.75,23.34 168.4,19.69 179.4,19.69 182.5,16.59 v193.45,16.59 193.45,16.54 194.75,15.24 | SPI3.7 19.39,7.4 20.25,6.54 146.75,6.54 149.05,8.84 149.05,29.54 v151.25,31.74
  Bottom 0.305: 20.55,138.19 20.5,138.14 20.5,135.47 SPI0.7 | 204.35,138.74 203.96,139.13 198.15,139.13 SPI1.7
  Bottom 0.406: 130.37,29.11 2560_PORTB.4 130.37,30.16
  Bottom 0.61: 20.55,138.19 20.55,138.54 18.7,140.39 12.2,140.39 9.17,137.86 9.17,99.36 5.1,95.29 5.1,65.34 7,63.44 7,11.49 10.4,8.09 17.16,8.09 SPI3.7 | EXTRA_SPI.4 163.39,28.95 160.6,31.74 v151.25,31.74 131.95,31.74 130.37,30.16 | 206.25,67.74 206.25,136.84 204.35,138.74 | 206.25,67.74 206.3,67.69 | 206.25,67.74 206.25,63.19 209.05,60.39 209.05,18.44 207,16.39 193.65,16.39 v193.45,16.59
MOSI  (via drill 0.7)
  Top 0.61: SPI2.6 198.83,8.07 v195.88,5.11 195.7,4.94 158.85,4.94 | 158.85,4.94 151.05,12.74 151.05,18.14 156.6,23.69 162.8,23.69 163.4,24.29 EXTRA_SPI.3 | v12.05,17.59 8,13.54 8,7.99 11.05,4.94 158.85,4.94
  Bottom 0.305: 129.1,31.09 129.1,27.47 2560_PORTB.3 | EXTRA_SPI.3 164.69,27.49 164.69,30.55
  Bottom 0.61: SPI3.6 16.5,13.21 16.5,16.19 15.15,17.54 12.1,17.54 v12.05,17.59 8.65,20.99 8.65,62.39 8.7,62.44 8.7,64.64 6.65,66.69 6.65,90.19 6.6,90.24 6.6,94.49 10.95,98.84 10.95,136.99 12.8,138.84 18.2,138.84 19.05,137.99 19.05,136.92 SPI0.6 | 129.1,31.09 131.3,33.29 161.95,33.29 164.69,30.55 | SPI1.6 194.36,141.3 197.05,143.99 207.65,143.99 209.55,142.09 209.55,64.49 212.15,61.89 212.15,11.39 207.05,6.29 197.05,6.29 v195.88,5.11
N$1
  Bottom 1.016: D2.C D1.A
N$2
  Bottom 1.016: 38.93,15.87 ESP.6 | 38.93,15.87 D1.C | ESP.2 37.61,15.87 38.93,15.87
N$3
  Bottom 1.27: 176.95,15.41 S1.2 177,17.04 175.8,18.24 162.9,18.24 161.66,17 SUPPLY.1
N$4
  Bottom 1.27: LED9.K 187.12,23.42 188.65,21.89 192.06,21.89 R5.2
N$7
  Bottom 0.406: PORTA.1 75.37,128.51 76.6,129.74 86.55,129.74 88.3,131.49 LED1.A
N$12
  Bottom 0.305: 74.1,129.69 74.1,126.68 PORTA.2
  Bottom 0.406: LED2.A 81.95,133.99 80.3,132.34 76.75,132.34 74.1,129.69
N$13
  Bottom 0.406: LED3.A 75.61,133.35 72.85,130.59 72.85,127.97 PORTA.3
N$14
  Bottom 0.305: 71.59,130.5 71.59,126.66 PORTA.4
  Bottom 0.406: 71.59,130.5 69.2,132.89 69.2,136.22 LED4.A
N$15
  Bottom 0.406: PORTA.5 70.3,130.14 66.45,133.99 63.55,133.99 62.95,134.59 62.95,136.24 LED5.A
N$16
  Bottom 0.305: 69.05,129.69 69.05,128.47 69.04,128.47 69.04,126.66 PORTA.6
  Bottom 0.406: 69.05,129.69 66.25,132.49 57.5,132.49 56.55,133.44 LED6.A
N$17
  Bottom 0.406: PORTA.7 67.75,129.24 65.85,131.14 51.35,131.14 50.2,132.29 LED7.A
N$18
  Bottom 0.305: 66.45,128.84 66.5,128.79 66.5,126.44 67.53,125.41 PORTA.8
  Bottom 0.406: 66.45,128.84 65.5,129.79 44.55,129.79 43.5,130.84 LED8.A
N$19
  Bottom 0.406: RN1.9 78.94,143 80.3,141.64 88.4,141.64 90.9,139.14 90.9,136.33 LED1.K
N$20
  Bottom 0.406: 84.29,136.28 LED2.K 84.5,139.49 83.55,140.44 79.75,140.44 76.4,143.79 RN1.8 76.4,143.84
N$21
  Bottom 0.406: R7.1 R8.2 33.85,13.04 35.44,11.45 ESP.1
N$22
  Bottom 0.406: RN1.7 73.86,142.83 78.15,138.54 LED3.K
N$23
  Bottom 0.406: RN1.6 71.32,136.76 LED4.K
N$24
  Bottom 0.406: LED5.K 65.45,139.39 68.85,142.79 68.85,144.1 RN1.5
N$25
  Bottom 0.406: LED6.K 59.1,138.69 59.8,139.39 61.46,139.39 RN1.4
N$26
  Bottom 0.406: LED7.K 52.75,139.09 54.15,140.49 60.02,140.49 RN1.3
N$27
  Bottom 0.406: LED8.K 46.05,139.34 48.35,141.64 58.63,141.64 RN1.2
OC1A  (via drill 0.7)
  Top 0.61: 32.68,73.29 MAIN_MOTOR1.2 52.55,73.19 80.65,45.09 v97.85,45.09 | 132.85,34.89 132.85,28.8 2560_PORTB.6 | 128.2,45.44 v128.4,45.44 129.25,45.44 132.85,41.84 132.85,34.89 | 132.8,34.94 132.85,34.89
  Bottom 0.61: v97.85,45.09 128.05,45.09 v128.4,45.44
OC1B  (via drill 0.7)
  Top 0.305: 134.2,27.04 134.2,31.09
  Top 0.406: 2560_PORTB.7 135.04,26.2 134.2,27.04
  Top 0.61: MAIN_MOTOR1.4 32.66,78.19 54.65,78.19 80.4,52.44 v82.75,52.44 | v124.95,52.44 134.2,43.19 134.2,31.09
  Bottom 0.61: v124.95,52.44 v82.75,52.44
OC1C  (via drill 0.7)
  Top 0.61: 2560_PORTB.8 135.45,54.34 137.5,56.39 177.1,56.39 v177.15,56.34
  Bottom 0.61: MAIN_MOTOR2.2 204.44,53.44 193.75,53.44 190.85,56.34 v177.15,56.34
OC3A  (via drill 0.7)
  Top 0.61: v61,58.54 57.95,55.49 57.95,28.77 PORTE.4 | v129.35,58.59 177.55,58.59 v177.8,58.84
  Bottom 0.61: v129.35,58.59 129.3,58.64 61.1,58.64 v61,58.54 | MAIN_MOTOR2.4 202.45,58.49 201.05,57.09 192.55,57.09 190.8,58.84 v177.8,58.84 177.5,58.84
OC3B  (via drill 0.7)
  Top 0.305: 61.6,31.69 61.6,31.34 61.8,31.14 61.8,27.48 PORTE.5
  Top 0.61: 61.6,31.69 61.6,33.99 63.55,35.94 102.3,35.94 103.3,36.94 v103.3,37.29 | v166.8,37.09 172.85,31.04 195.2,31.04 198.6,27.64 201.44,27.64 BLDC_PORT.4
  Bottom 0.61: v166.8,37.09 166.6,37.29 v103.3,37.29 103.1,37.29
OC3C  (via drill 0.7)
  Top 0.305: 199.95,31.44 202.72,31.44 BLDC_PORT.5
  Top 0.61: 199.95,31.44 198.9,31.44 196.85,33.49 174.55,33.49 174.55,33.64 v169.25,38.94 | PORTE.6 59.85,29.41 59.85,35.59 63.75,39.49 80.3,39.49 v80.45,39.34
  Bottom 0.61: v169.25,38.94 168.85,39.34 v80.45,39.34
PISTON1
  Bottom 0.61: PORTJ.4 116.4,122.64 117.3,121.74 189.05,121.74 MOSFET_DRIVER.1
PISTON2
  Bottom 0.305: MOSFET_DRIVER.2 191.22,123.97 191.22,121.16 191.05,120.99 | 115.15,120.94 115.15,126.51 PORTJ.5
  Bottom 0.61: 191.1,120.99 191.05,120.99 190.2,120.14 115.95,120.14 115.15,120.94
PISTON3
  Bottom 0.61: PORTJ.6 113.86,120.13 115.45,118.54 191.25,118.54 192.5,119.79 192.5,122.65 MOSFET_DRIVER.3
PISTON4
  Bottom 0.305: PORTJ.7 112.56,126.55 112.56,124.11 112.2,123.74 | MOSFET_DRIVER.4 193.8,123.93 193.8,118.59
  Bottom 0.406: 193.8,118.59 193.85,118.54
  Bottom 0.61: 112.2,123.74 112.2,119.54 114.9,116.84 192.2,116.84 193.85,118.54
RXD0_PE0
  Bottom 0.406: PORTE.1 55.4,26.24 49,26.24 48.75,26.24 46.05,26.24 42.1,22.29 42.1,15.24 ESP.8
RXD1_PD2
  Bottom 0.406: LSA2.1 202.75,74.74 201.25,73.24 191.28,73.24 PORTD.3
RXD2_PH0
  Bottom 0.305: 10.6,78.09 11.75,79.24 14,79.24 15.14,78.1 LSA3.1
  Bottom 0.406: 10.7,78.09 10.6,78.09
  Bottom 0.61: 10.6,78.09 10.6,72.89 21.2,62.29 38.55,62.29 74.64,26.2 PORTH.1
RXD3_PJ0
  Bottom 0.406: PORTJ.1 118.94,136.63 121.05,138.74 121.05,140.93 LSA4.1
SCK  (via drill 0.7)
  Top 0.61: SPI2.8 196.29,8.28 194.4,6.39 169.2,6.39 165.85,9.74 165.85,17.29 164.85,18.29 164.8,18.29 v160.9,22.19 160.8,22.29 | SPI3.8 19.39,18.05 18.1,19.34 10.45,19.34 v5.15,14.04
  Bottom 0.305: 20.55,6.69 20.65,6.79 | 19.48,12.86 SPI3.8 | EXTRA_SPI.2 162.15,27.45 162.15,25.68 | 162.15,25.68 | 162.15,25.68 162.15,23.64
  Bottom 0.61: SPI0.8 22,136.93 22,138.94 19.25,141.69 11.5,141.69 7.4,138.2 7.4,99.89 3.1,95.59 3.1,63.49 5.15,61.44 v5.15,14.04 5.15,10.54 9,6.69 20.55,6.69 22.8,6.69 24.1,5.39 29.95,5.39 30,5.44 | 2560_PORTB.2 126.8,28.74 125.9,27.84 125.9,23.84 127.45,22.29 142.15,22.29 | 30,5.44 29.45,5.44 | 30,5.44 134.3,5.44 136.65,7.79 136.65,16.79 142.15,22.29 | SPI1.8 196.9,141.74 197.75,142.59 206.6,142.59 207.95,141.24 207.95,63.79 210.65,61.09 210.65,13.49 205.5,8.34 198.07,8.34 SPI2.8 | 142.15,22.29 160.8,22.29 | 160.8,22.29 v160.9,22.19 | 162.15,23.64 160.8,22.29
SS
  Bottom 0.61: 2560_PORTB.1 127.83,24.61 128.85,23.59 158.24,23.59 EXTRA_SPI.1
SS0
  Top 0.61: PORTK.1 33.85,94.94 31.95,93.04 28.55,93.04 24.65,96.94 24.65,127.74 19.25,133.14 SPI0.5
SS1
  Top 0.61: SPI1.5 194.36,136.89 192.36,134.89 187.25,134.89 186.7,135.44 185.7,136.44 184.9,137.24 110.85,137.24 105.4,131.79 33.05,131.79 28.8,127.54 28.8,98.56 PORTK.2
SS2  (via drill 0.7)
  Top 0.305: 167.2,30.59 167.2,24.19
  Top 0.61: SPI2.5 198.83,13.91 194.15,18.59 182.8,18.59 179.35,22.04 169.35,22.04 167.2,24.19 | v162.8,34.99 167.2,30.59
  Bottom 0.61: v162.8,34.99 77.2,34.99 43.75,68.44 43.65,68.34 27.45,68.34 25.15,70.64 25.15,81.34 28.9,85.09 35.35,85.09 39.3,89.04 39.3,95.64 36.35,98.59 PORTK.3
SS3
  Bottom 0.305: 18.1,14.24 18.1,11.57 SPI3.5 | 17.15,84.29 8.9,84.29 8.05,83.44
  Bottom 0.61: 8.05,83.44 8.05,67.64 10.2,65.49 10.2,25.69 10.25,25.64 10.25,21.59 12.45,19.39 16.95,19.39 18.1,18.24 18.1,14.24 | PORTK.4 25.15,98.59 18.3,91.74 18.3,85.39 17.15,84.29
T4
  Bottom 0.305: PORTH.8 99.9,27.48 99.9,24.39
  Bottom 0.406: 99.9,24.39 98.1,22.59 84.35,22.59 81.9,20.14 81.9,12.34 ENCODER1.2
T5
  Top 0.61: PORTL.3 146.14,50.13 142.35,46.34 142.35,13.18 ENCODER2.2
TXD0_PE1
  Bottom 0.406: PORTE.2 48.25,28.74 45.55,31.44 36.55,31.44 R8.1
TXD1_PD3
  Bottom 0.305: 187.18,79.52 184.96,79.52 PORTD.4
  Bottom 0.406: 187.18,79.52 191,75.69 200.19,75.69 LSA2.2
TXD2_PH1
  Bottom 0.61: PORTH.2 93.34,28.54 76.15,28.54 40.45,64.24 22.1,64.24 12.3,74.04 12.3,77.65 LSA3.2
TXD3_PJ1
  Bottom 0.305: PORTJ.2 117.65,126.55 117.65,128.89
  Bottom 0.406: LSA4.2 117.65,139.21 117.65,128.89

### Text on the board
Top: Messenger Robot 1
Bottom: Messenger Robot 1
tNames: ROBOCON'19 | Messenger Robot 1 | Messenger Robot 1